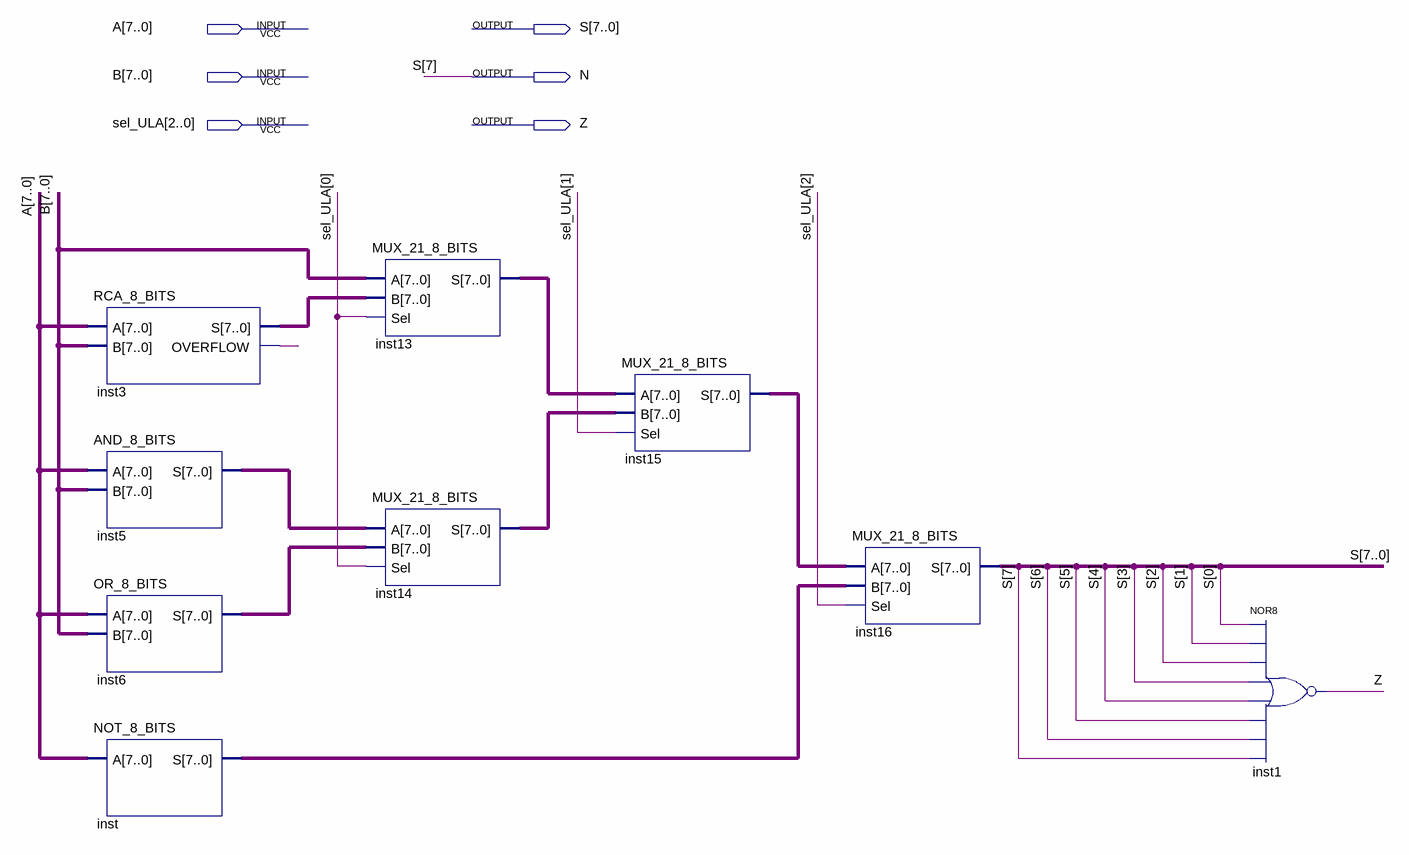
[diagram p0: schematic sheet]
// Quartus schematic ULA.bdf as structural Verilog: 9 symbols, 6 pins
module ULA (
  input  [7:0] A,
  input  [7:0] B,
  input  [2:0] sel_ULA,
  output [7:0] S,
  output N,
  output Z
);

  wire inst3_overflow;
  wire [7:0] inst3_s, inst5_s, inst6_s, inst13_s, inst14_s, inst15_s, inst_s;

  RCA_8_BITS inst3 (.A(A), .B(B), .S(inst3_s), .OVERFLOW(inst3_overflow));
  AND_8_BITS inst5 (.A(A), .B(B), .S(inst5_s));
  OR_8_BITS inst6 (.A(A), .B(B), .S(inst6_s));
  NOT_8_BITS inst (.A(A), .S(inst_s));
  MUX_21_8_BITS inst13 (.A(B), .B(inst3_s), .Sel(sel_ULA[0]), .S(inst13_s));
  MUX_21_8_BITS inst14 (.A(inst5_s), .B(inst6_s), .Sel(sel_ULA[0]), .S(inst14_s));
  MUX_21_8_BITS inst15 (.A(inst13_s), .B(inst14_s), .Sel(sel_ULA[1]), .S(inst15_s));
  MUX_21_8_BITS inst16 (.A(inst15_s), .B(inst_s), .Sel(sel_ULA[2]), .S({N, S[6:0]}));
  nor inst1 (Z, S[0], S[1], S[2], S[3], S[4], S[5], S[6], N);

  assign S[7] = N;
endmodule
